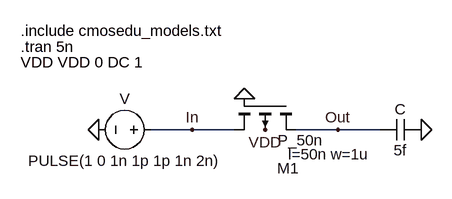
[diagram p0: schematic Draft1.asc]
Draft1.asc, the LTspice schematic file:
Version 4
SHEET 1 880 680
WIRE 96 208 32 208
WIRE 160 208 96 208
WIRE 320 208 256 208
WIRE 384 208 320 208
FLAG 208 208 VDD
FLAG -48 208 0
FLAG 448 208 0
FLAG 176 160 0
FLAG 96 208 In
FLAG 320 208 Out
SYMBOL pmos4 256 160 R90
WINDOW 0 107 -4 VRight 2
WINDOW 3 64 -41 VRight 2
WINDOW 123 86 -113 VRight 2
SYMATTR InstName M1
SYMATTR Value P_50n
SYMATTR Value2 l=50n w=1u
SYMBOL cap 448 192 R90
WINDOW 0 0 32 VBottom 2
WINDOW 3 32 32 VTop 2
SYMATTR InstName C
SYMATTR Value 5f
SYMBOL voltage 48 208 R90
WINDOW 0 -32 56 VBottom 2
WINDOW 3 32 56 VTop 2
WINDOW 123 0 0 Left 0
WINDOW 39 0 0 Left 0
SYMATTR InstName V
SYMATTR Value PULSE(1 0 1n 1p 1p 1n 2n)
TEXT -168 104 Left 2 !VDD VDD 0 DC 1
TEXT -168 56 Left 2 !.include cmosedu_models.txt
TEXT -168 80 Left 2 !.tran 5n

The netlist it stands for:
* Draft1.asc
M1 Out 0 In VDD P_50n l=50n w=1u
C 0 Out 5f
V In 0 PULSE(1 0 1n 1p 1p 1n 2n)
.model NMOS NMOS
.model PMOS PMOS
.lib standard.mos
VDD VDD 0 DC 1
.include cmosedu_models.txt
.tran 5n
.backanno
.end

* Results of the author's LTspice run, read from the files saved beside the schematic
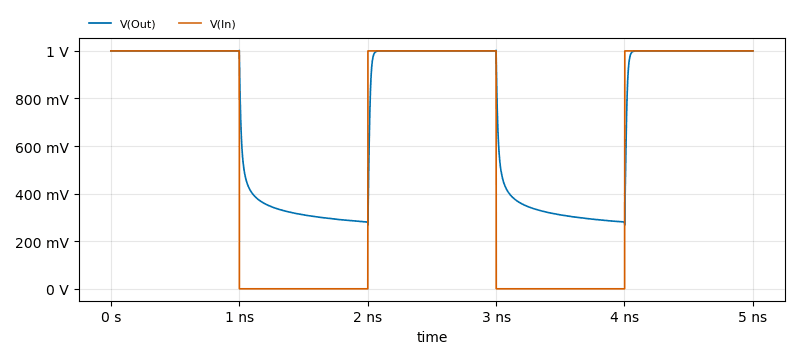
[diagram p1: Transient Analysis of Draft1.asc, plotted from the saved traces]
* Transient Analysis, 1 run:
*   V(Out): min 268.1 mV, max 1.002 V, average 729.7 mV, rms 800.4 mV, last 1 V
*   V(In): min 0 V, max 1 V, average 599.6 mV, rms 774.3 mV, last 1 V